# EasyEDA schematic seedrum_triac_v1.json
TITLE: Seedup Triac; REV: 1.0; Date: 2020-10-29; Sheet: 1/1; Drawn By: Victor Halla; Company: Seedup
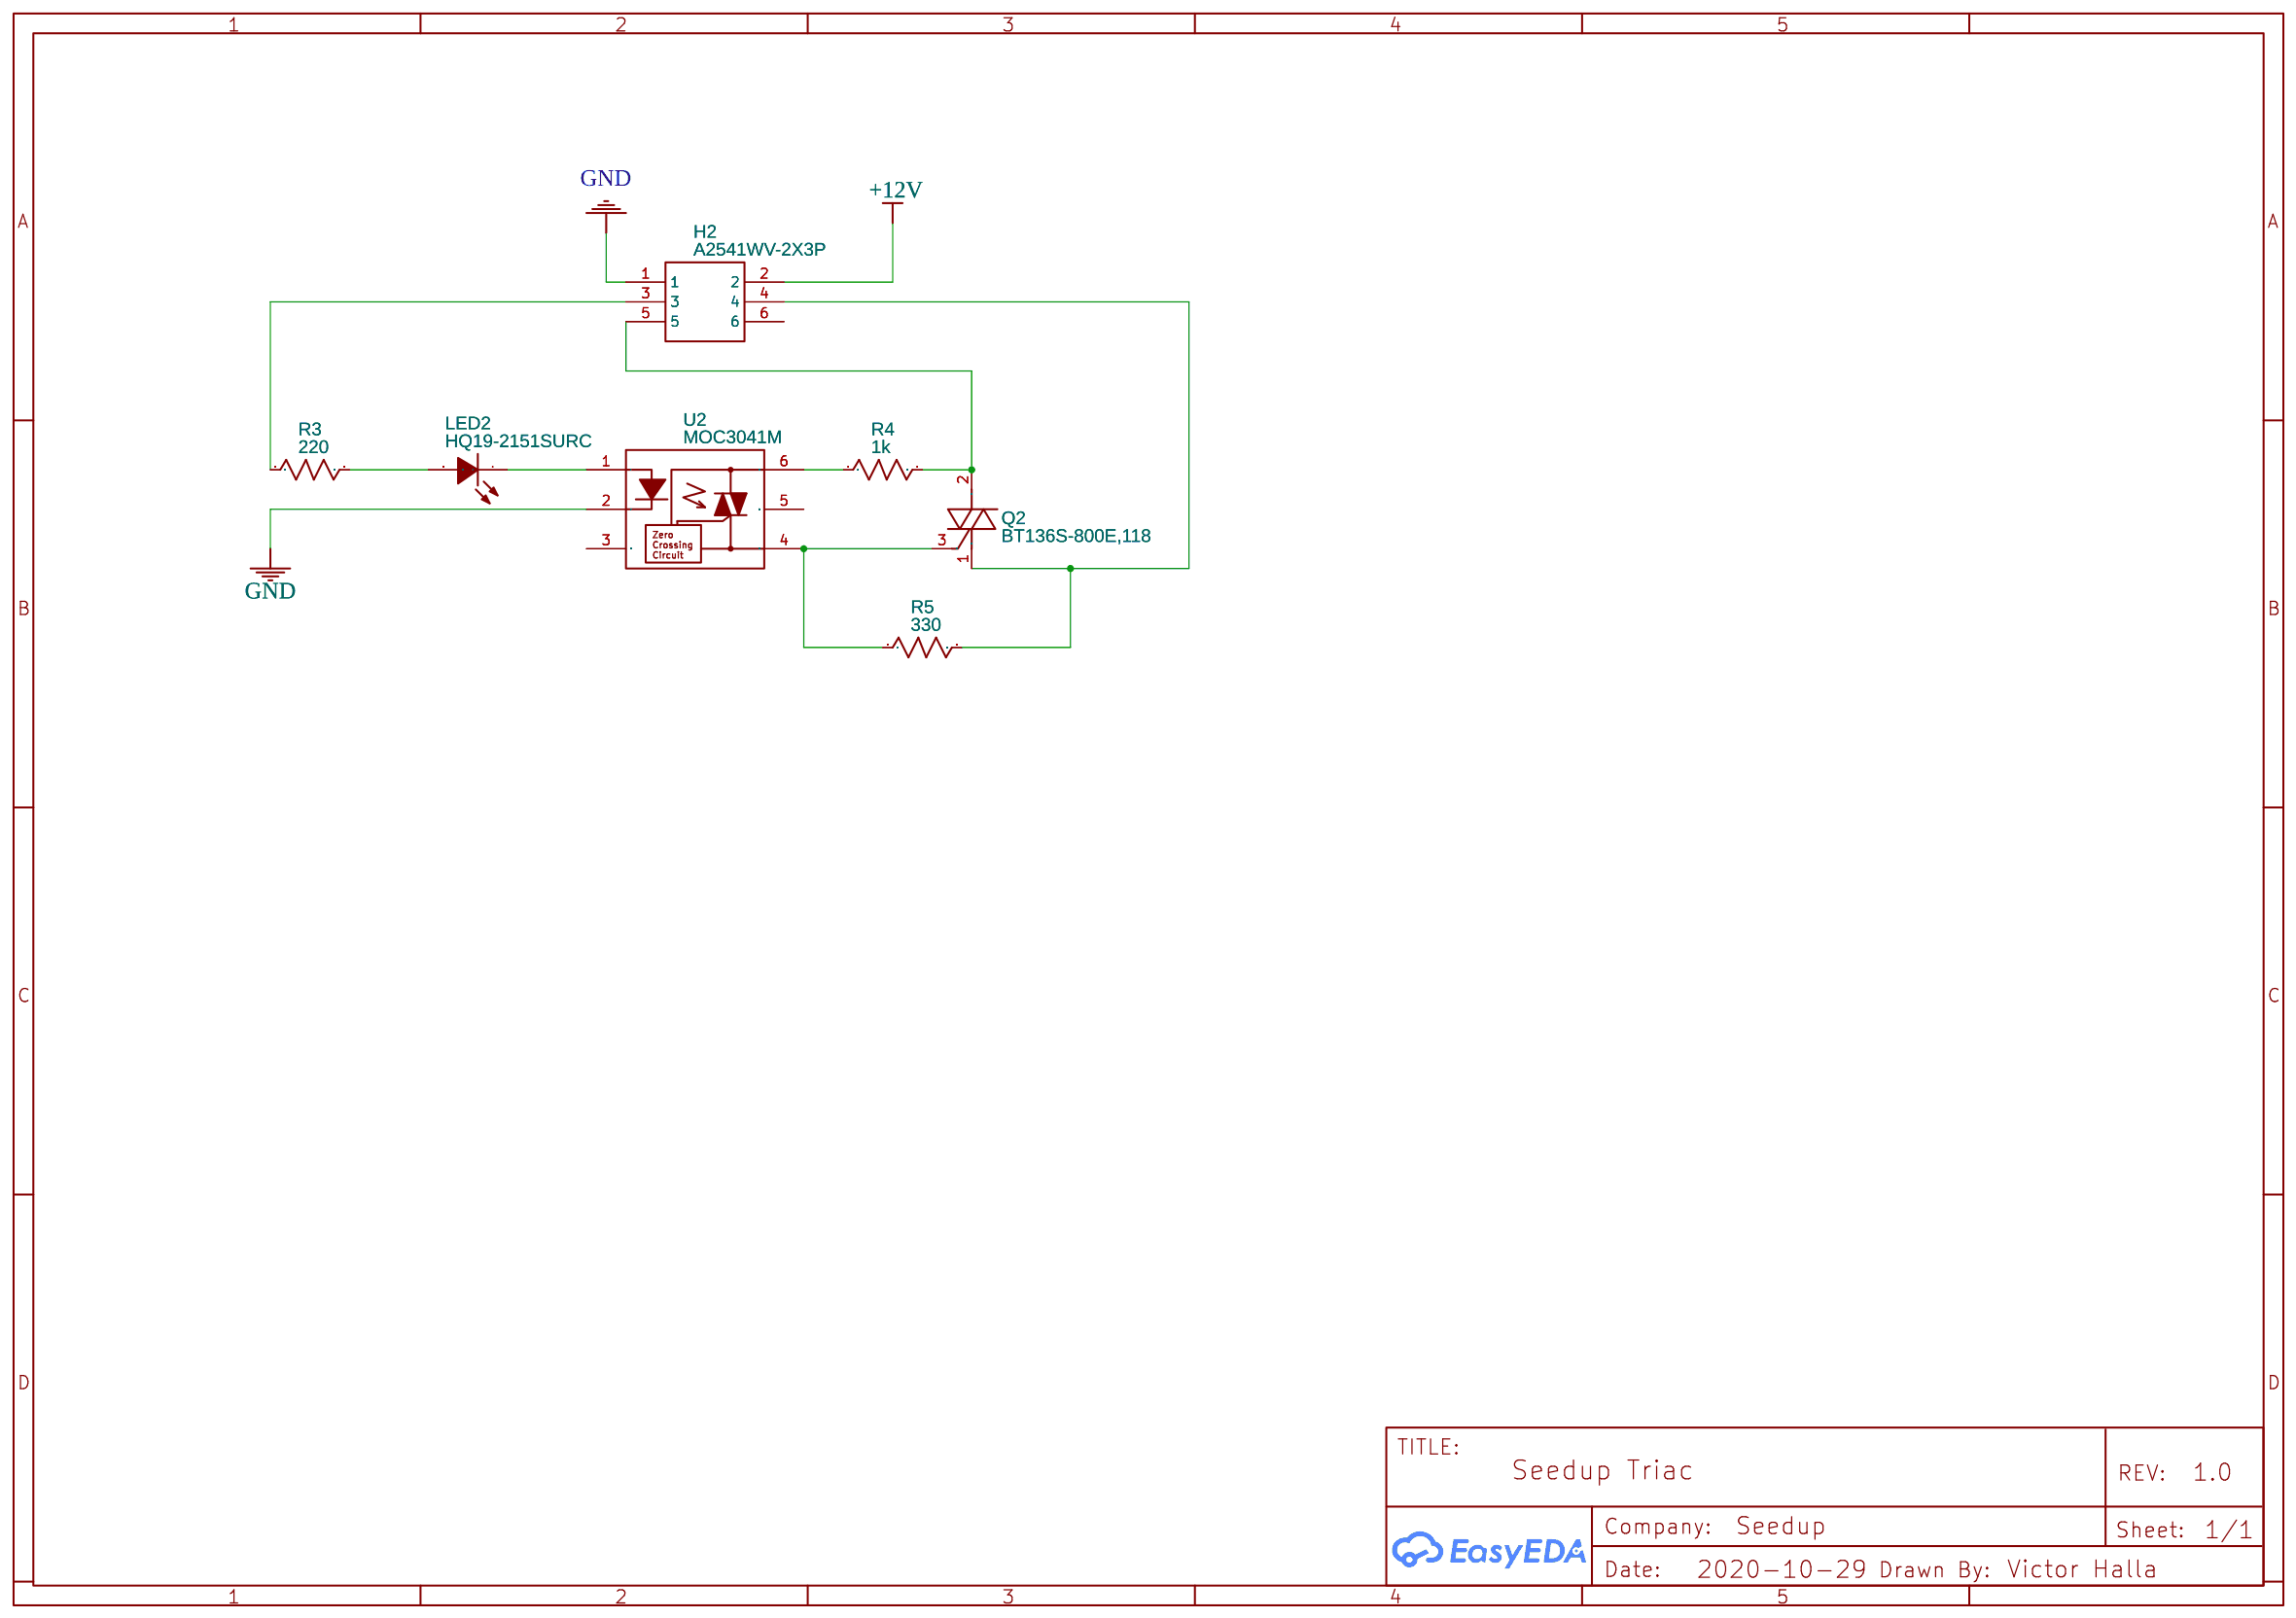
[diagram p0: schematic sheet]

## Parts
H2  A2541WV-2X3P  [HDR-TH_6P-P2.54-V-R2-C3-S2.54_A2541WV-2X3P]
LED2  HQ19-2151SURC  [LED0603-RD]
Q2  BT136S-800E,118  [DPAK-3_L6.6-W6.1-P2.28-LS9.9-BR]
R3  220  [R0603]
R4  1k  [R0603]
R5  330  [R0603]
U2  MOC3041M  [DIP-6_L8.5-W6.4-P2.54-LS7.6-BL]

## Library data of the parts
H2 = A2541WV-2X3P: Supplier: LCSC; Supplier Part: C225518; Manufacturer: Changjiang Connectors; Manufacturer Part: A2541WV-2x3P; Contributor: LCSC
LED2 = HQ19-2151SURC: Supplier: LCSC; Supplier Part: C258842; Manufacturer: Harvatek Optoelectronics (Shenzhen); Contributor: LCSC
Q2 = BT136S-800E,118: Supplier: LCSC; Supplier Part: C581422; Manufacturer: WeEn; Contributor: LCSC
R3-R5 = R_0603_US: Contributor: LCEDA_Lib
U2 = MOC3041M: Supplier: LCSC; Manufacturer: FAIRCHILD; image: //image.lceda.cn/szlcsc/C8921.jpg; Supplier Part: C8921

## Nets
+12V: H2.2
GND: H2.1 U2.2(K)
Net-(H2-3): H2.3 R3.1
Net-(H2-4): H2.4 Q2.1(T1) R5.2
Net-(H2-5): H2.5 Q2.2(T2) R4.2
Net-(LED2-1): LED2.1(K) U2.1(A)
Net-(LED2-2): LED2.2(A) R3.2
Net-(Q2-3): Q2.3(G) R5.1 U2.4(T2)
Net-(R4-1): R4.1 U2.6(T1)

Not connected (* = marked no-connect by the designer): H2 6; U2 3(NC) 5(NC)
